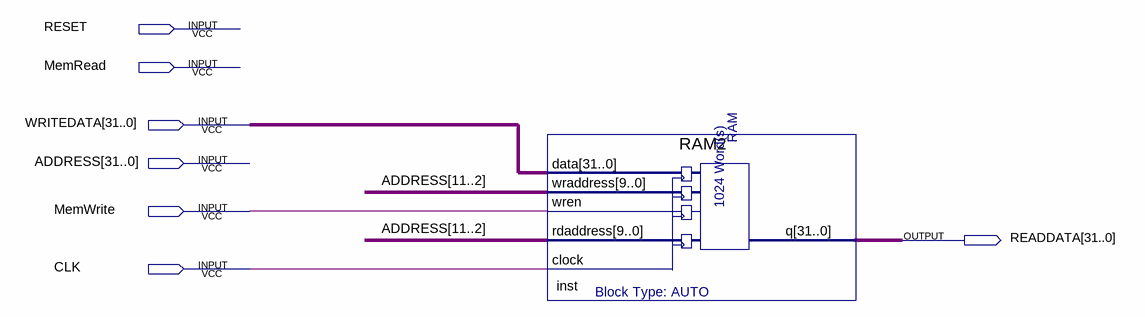
[diagram p0: schematic sheet]
// Quartus schematic DataMemory.bdf as structural Verilog: 1 symbols, 7 pins
module DataMemory (
  input  RESET,
  input  MemRead,
  input  [31:0] WRITEDATA,
  input  [31:0] ADDRESS,
  input  MemWrite,
  input  CLK,
  output [31:0] READDATA
);

  RAM2 inst (
    .data(WRITEDATA), .wraddress(ADDRESS[11:2]), .wren(MemWrite), .rdaddress(ADDRESS[11:2]), .clock(CLK),
    .q(READDATA));
endmodule
